# Altium schematic sheet AFE1.SchDoc
size A4
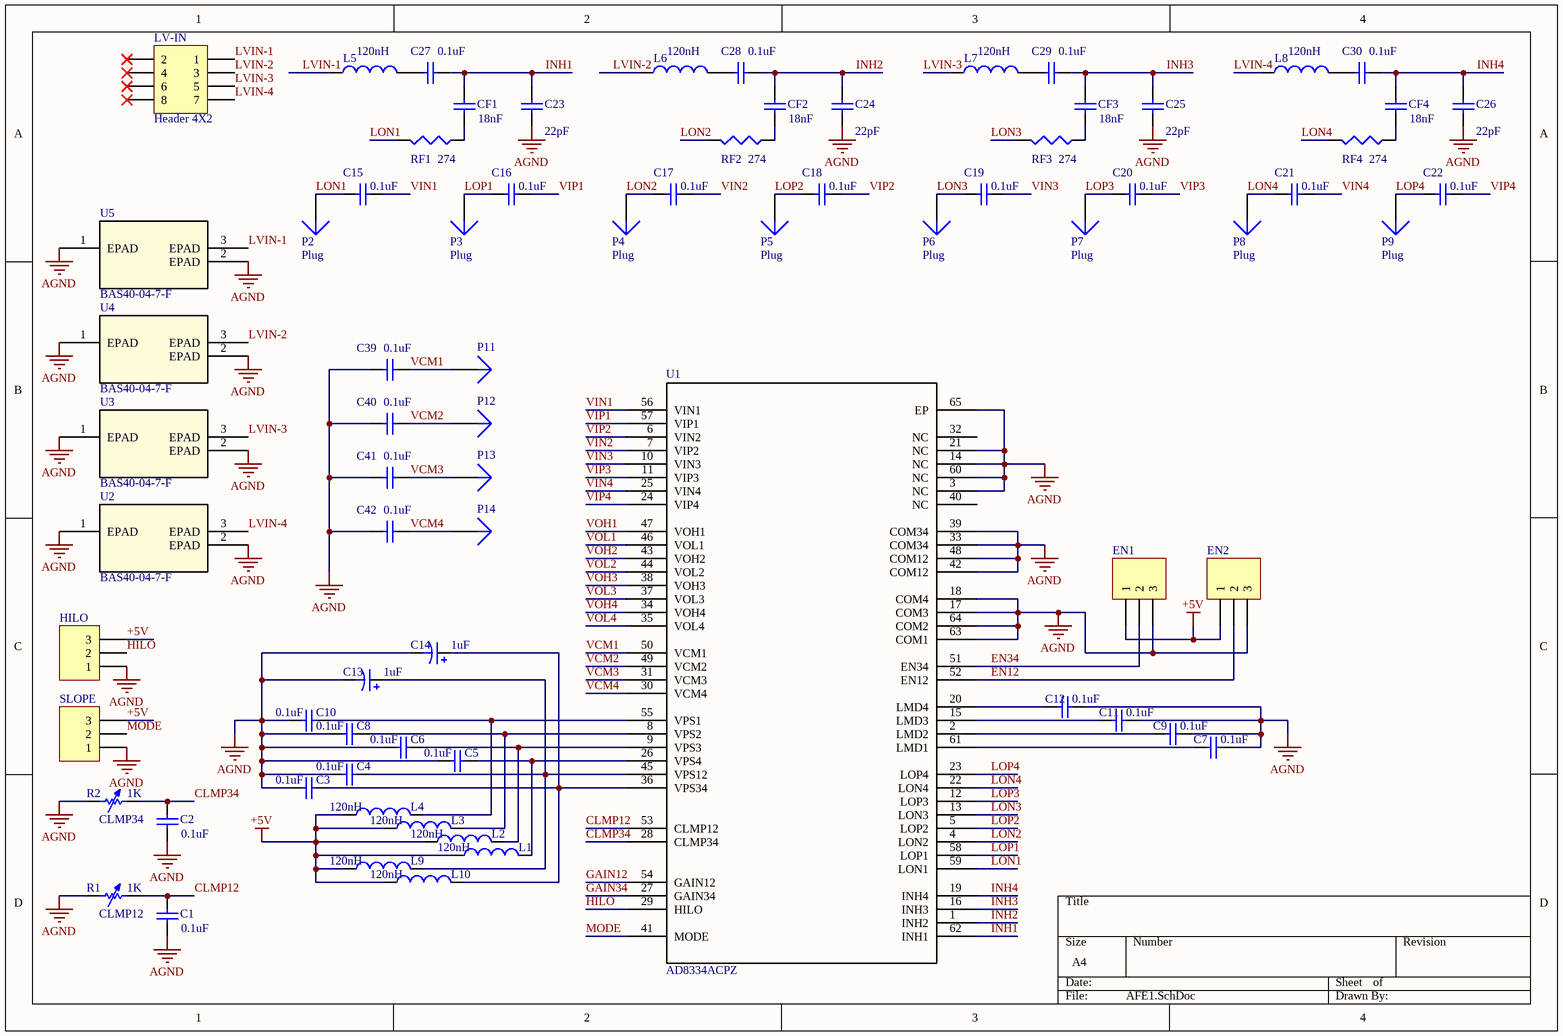
[diagram p0: AFE1.SchDoc]

## Parts
C1  value 0.1uF  [1608[0603]]
C2  value 0.1uF  [1608[0603]]
C3  value 0.1uF  [1608[0603]]
C4  value 0.1uF  [1608[0603]]
C5  value 0.1uF  [1608[0603]]
C6  value 0.1uF  [1608[0603]]
C7  value 0.1uF  [1608[0603]]
C8  value 0.1uF  [1608[0603]]
C9  value 0.1uF  [1608[0603]]
C10  value 0.1uF  [1608[0603]]
C11  value 0.1uF  [1608[0603]]
C12  value 0.1uF  [1608[0603]]
C13  value 1uF  [C0805]
C14  value 1uF  [C0805]
C15  value 0.1uF  [1608[0603]]
C16  value 0.1uF  [1608[0603]]
C17  value 0.1uF  [1608[0603]]
C18  value 0.1uF  [1608[0603]]
C19  value 0.1uF  [1608[0603]]
C20  value 0.1uF  [1608[0603]]
C21  value 0.1uF  [1608[0603]]
C22  value 0.1uF  [1608[0603]]
C23  value 22pF  [1608[0603]]
C24  value 22pF  [1608[0603]]
C25  value 22pF  [1608[0603]]
C26  value 22pF  [1608[0603]]
C27  value 0.1uF  [1608[0603]]
C28  value 0.1uF  [1608[0603]]
C29  value 0.1uF  [1608[0603]]
C30  value 0.1uF  [1608[0603]]
C39  value 0.1uF  [1608[0603]]
C40  value 0.1uF  [1608[0603]]
C41  value 0.1uF  [1608[0603]]
C42  value 0.1uF  [1608[0603]]
CF1  value 18nF  [1608[0603]]
CF2  value 18nF  [1608[0603]]
CF3  value 18nF  [1608[0603]]
CF4  value 18nF  [1608[0603]]
EN1  (no value)  [HDR1X3]
EN2  (no value)  [HDR1X3]
HILO  (no value)  [HDR1X3]
L1  value 120nH  [INDC1608L]
L2  value 120nH  [INDC1608L]
L3  value 120nH  [INDC1608L]
L4  value 120nH  [INDC1608L]
L5  value 120nH  [INDC1608L]
L6  value 120nH  [INDC1608L]
L7  value 120nH  [INDC1608L]
L8  value 120nH  [INDC1608L]
L9  value 120nH  [INDC1608L]
L10  value 120nH  [INDC1608L]
LV-IN  Header 4X2  [HDR2X4]
P2  Plug  [PIN1]
P3  Plug  [PIN1]
P4  Plug  [PIN1]
P5  Plug  [PIN1]
P6  Plug  [PIN1]
P7  Plug  [PIN1]
P8  Plug  [PIN1]
P9  Plug  [PIN1]
P11  (no value)  [PIN1]
P12  (no value)  [PIN1]
P13  (no value)  [PIN1]
P14  (no value)  [PIN1]
R1  CLMP12  value 1K  [SMB]
R2  CLMP34  value 1K  [SMB]
RF1  value 274  [J1-0603]
RF2  value 274  [J1-0603]
RF3  value 274  [J1-0603]
RF4  value 274  [J1-0603]
SLOPE  (no value)  [HDR1X3]
U1  AD8334ACPZ  [CP_64_1]
U2  BAS40-04-7-F  [SOT-23]
U3  BAS40-04-7-F  [SOT-23]
U4  BAS40-04-7-F  [SOT-23]
U5  BAS40-04-7-F  [SOT-23]

## Nets
+5V: EN1.1 EN2.1 HILO.3 L1.1 L2.1 L3.1 L4.1 L9.1 L10.1 SLOPE.3
AGND: C1.1 C2.1 C3.1 C4.1 C5.1 C6.1 C7.1 C8.1 C9.1 C10.1 C11.1 C12.1 C13.2 C14.2 C23.1 C24.1 C25.1 C26.1 C39.2 C40.2 C41.2 C42.2 EN1.3 EN2.3 HILO.1 R1.1 R2.1 SLOPE.1 U1.3(NC) U1.14(NC) U1.17(COM3) U1.18(COM4) U1.21(NC) U1.33(COM34) U1.39(COM34) U1.42(COM12) U1.48(COM12) U1.60(NC) U1.63(COM1) U1.64(COM2) U1.65(EP) U2.1(EPAD) U2.2(EPAD) U3.1(EPAD) U3.2(EPAD) U4.1(EPAD) U4.2(EPAD) U5.1(EPAD) U5.2(EPAD)
CLMP12: C1.2 R1.2 U1.53(CLMP12)
CLMP34: C2.2 R2.2 U1.28(CLMP34)
EN12: EN2.2 U1.52(EN12)
EN34: EN1.2 U1.51(EN34)
GAIN12: U1.54(GAIN12)
GAIN34: U1.27(GAIN34)
HILO: HILO.2 U1.29(HILO)
INH1: C23.2 C27.2 CF1.2 U1.62(INH1)
INH2: C24.2 C28.2 CF2.2 U1.1(INH2)
INH3: C25.2 C29.2 CF3.2 U1.16(INH3)
INH4: C26.2 C30.2 CF4.2 U1.19(INH4)
LON1: C15.1 P2.1 RF1.2 U1.59(LON1)
LON2: C17.1 P4.1 RF2.2 U1.4(LON2)
LON3: C19.1 P6.1 RF3.2 U1.13(LON3)
LON4: C21.1 P8.1 RF4.2 U1.22(LON4)
LOP1: C16.1 P3.1 U1.58(LOP1)
LOP2: C18.1 P5.1 U1.5(LOP2)
LOP3: C20.1 P7.1 U1.12(LOP3)
LOP4: C22.1 P9.1 U1.23(LOP4)
LVIN-1: L5.1 LV-IN.1 U5.3(EPAD)
LVIN-2: L6.1 LV-IN.3 U4.3(EPAD)
LVIN-3: L7.1 LV-IN.5 U3.3(EPAD)
LVIN-4: L8.1 LV-IN.7 U2.3(EPAD)
MODE: SLOPE.2 U1.41(MODE)
VCM1: C39.1 P11.1 U1.50(VCM1)
VCM2: C40.1 P12.1 U1.49(VCM2)
VCM3: C41.1 P13.1 U1.31(VCM3)
VCM4: C42.1 P14.1 U1.30(VCM4)
VIN1: C15.2 U1.56(VIN1)
VIN2: C17.2 U1.7(VIP2)
VIN3: C19.2 U1.10(VIN3)
VIN4: C21.2 U1.25(VIN4)
VIP1: C16.2 U1.57(VIP1)
VIP2: C18.2 U1.6(VIN2)
VIP3: C20.2 U1.11(VIP3)
VIP4: C22.2 U1.24(VIP4)
VOH1: U1.47(VOH1)
VOH2: U1.43(VOH2)
VOH3: U1.38(VOH3)
VOH4: U1.34(VOH4)
VOL1: U1.46(VOL1)
VOL2: U1.44(VOL2)
VOL3: U1.37(VOL3)
VOL4: U1.35(VOL4)
NetC3_2: C3.2 C14.1 L10.2 U1.36(VPS34)
NetC4_2: C4.2 C13.1 L9.2 U1.45(VPS12)
NetC5_2: C5.2 L1.2 U1.26(VPS4)
NetC6_2: C6.2 L2.2 U1.9(VPS3)
NetC7_2: C7.2 U1.61(LMD1)
NetC8_2: C8.2 L3.2 U1.8(VPS2)
NetC9_2: C9.2 U1.2(LMD2)
NetC10_2: C10.2 L4.2 U1.55(VPS1)
NetC11_2: C11.2 U1.15(LMD3)
NetC12_2: C12.2 U1.20(LMD4)
NetC27_1: C27.1 L5.2
NetC28_1: C28.1 L6.2
NetC29_1: C29.1 L7.2
NetC30_1: C30.1 L8.2
NetCF1_1: CF1.1 RF1.1
NetCF2_1: CF2.1 RF2.1
NetCF3_1: CF3.1 RF3.1
NetCF4_1: CF4.1 RF4.1

Not connected (* = marked no-connect by the designer): LV-IN 2* 4* 6* 8*; U1 32(NC) 40(NC)

## Library data of the parts
C1-C12 C15-C30 C39-C42 CF1-CF4 = Cap Semi: Capacitor (Semiconductor SIM Model); Published: 8-Jun-2000; LatestRevisionDate: 29-May-2009; LatestRevisionNote: IPC-7351 Footprint Added.; PackageReference: C1206; Publisher: Altium Limited; PackageDescription: Chip Capacitor
C13 C14 = Cap Pol3: Polarized Capacitor (Surface Mount); Published: 8-Jun-2000; LatestRevisionDate: 29-May-2009; LatestRevisionNote: IPC-7351 Footprint Added.; PackageReference: C0805; Publisher: Altium Limited; PackageDescription: Chip Capacitor
EN1 EN2 HILO SLOPE = Header 3: Header, 3-Pin; LatestRevisionDate: 17-Jul-2002; LatestRevisionNote: Re-released for DXP Platform.; Publisher: Altium Limited
L1-L10 = Inductor: Code_IEC: 1005; Published: 8-Jun-2000; LatestRevisionDate: 29-May-2009; LatestRevisionNote: IPC-7351 Footprint Added.; PackageReference: 0402-A; Publisher: Altium Limited; PackageDescription: Chip Inductor; Code_JEITA: 0402
LV-IN = Header 4X2: Header, 4-Pin, Dual row; LatestRevisionDate: 17-Jul-2002; LatestRevisionNote: Re-released for DXP Platform.; Publisher: Altium Limited
P11-P14 = Plug: LatestRevisionDate: 17-Jul-2002; LatestRevisionNote: Re-released for DXP Platform.; Publisher: Altium Limited
R1 R2 = Res Adj1: Variable Resistor; Set Position: 0.5; Published: 8-Jun-2000; LatestRevisionDate: 17-Jul-2002; LatestRevisionNote: Re-released for DXP Platform.; PackageReference: AXIAL-0.7; Publisher: Altium Limited; PackageDescription: Axial Device, Thru-Hole; 2 Leads; 0.7 in Pin Spacing
RF1-RF4 = Res3: Resistor; Published: 8-Jun-2000; LatestRevisionDate: 29-May-2009; LatestRevisionNote: IPC-7351 Footprint Added.; PackageReference: J1-0603; Publisher: Altium Limited; PackageDescription: Chip Resistor
U1 = AD8334ACPZ: Imported; RefDes: RefDes; Type: DEV; Value: Value
U2-U5 = BAS40-04-7-F: Imported; Vendor: Diodes Inc; Built_By: EMA_UL_Team; Manufacturer_Part_Number: BAS40-04-7-F; Value: Value; Type: Type; RefDes: RefDes
P2-P9 = Plug: LatestRevisionDate: 17-Jul-2002; LatestRevisionNote: Re-released for DXP Platform.; Publisher: Altium Limited